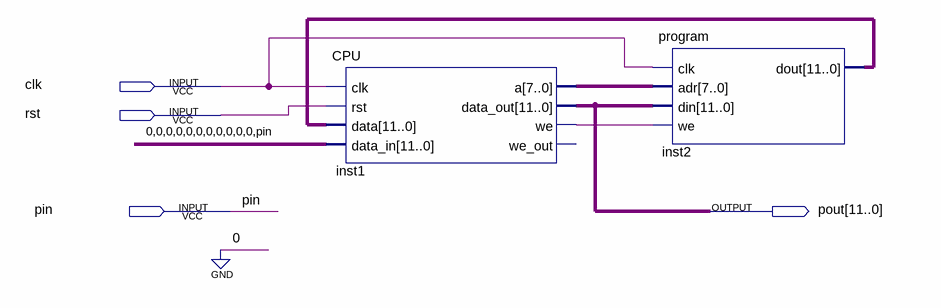
[diagram p0: schematic sheet]
// Quartus schematic ProcBlock.bdf as structural Verilog: 2 symbols, 4 pins
module ProcBlock (
  input  clk,
  input  rst,
  input  pin,
  output [11:0] pout
);

  wire inst1_we;
  wire [7:0] inst1_a;
  wire [11:0] inst2_dout;

  CPU inst1 (
    .clk(clk), .rst(rst), .data(inst2_dout), .data_in({{11{1'b0}}, pin}), .a(inst1_a), .we(inst1_we),
    .data_out(pout));  // open: we_out
  \program  inst2 (.clk(clk), .adr(inst1_a), .din(pout), .we(inst1_we), .dout(inst2_dout));
endmodule
